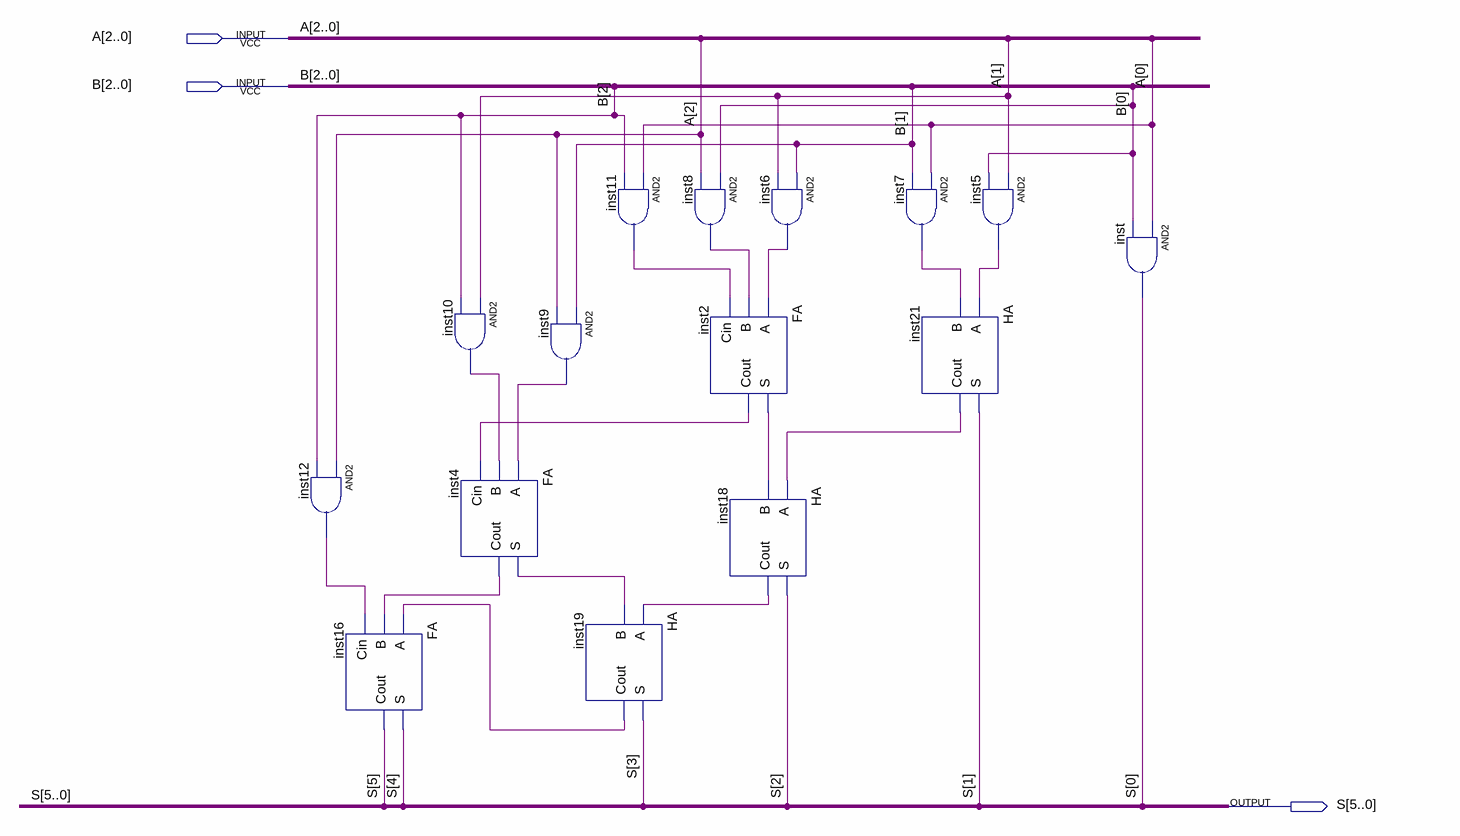
[diagram p0: schematic sheet]
// Quartus schematic mul3Bit.bdf as structural Verilog: 15 symbols, 3 pins
module mul3Bit (
  input  [2:0] A,
  input  [2:0] B,
  output [5:0] S
);

  wire inst2_cout, inst2_s, inst4_cout, inst4_s, inst5_out, inst6_out, inst7_out, inst8_out, inst9_out,
       inst10_out, inst11_out, inst12_out, inst18_cout, inst19_cout, inst21_cout;

  and inst12 (inst12_out, A[2], B[2]);
  FA inst16 (.A(inst19_cout), .B(inst4_cout), .Cin(inst12_out), .S(S[4]), .Cout(S[5]));
  and inst10 (inst10_out, A[1], B[2]);
  FA inst4 (.A(inst9_out), .B(inst10_out), .Cin(inst2_cout), .S(inst4_s), .Cout(inst4_cout));
  and inst9 (inst9_out, B[1], A[2]);
  HA inst19 (.A(inst18_cout), .B(inst4_s), .S(S[3]), .Cout(inst19_cout));
  and inst11 (inst11_out, A[0], B[2]);
  and inst8 (inst8_out, B[0], A[2]);
  FA inst2 (.A(inst6_out), .B(inst8_out), .Cin(inst11_out), .S(inst2_s), .Cout(inst2_cout));
  HA inst18 (.A(inst21_cout), .B(inst2_s), .S(S[2]), .Cout(inst18_cout));
  and inst6 (inst6_out, B[1], A[1]);
  and inst7 (inst7_out, A[0], B[1]);
  HA inst21 (.A(inst5_out), .B(inst7_out), .S(S[1]), .Cout(inst21_cout));
  and inst5 (inst5_out, A[1], B[0]);
  and inst (S[0], A[0], B[0]);
endmodule
